# Altium schematic sheet Sheet2.SchDoc
size A4; SheetNumber: 2; SheetTotal: 3
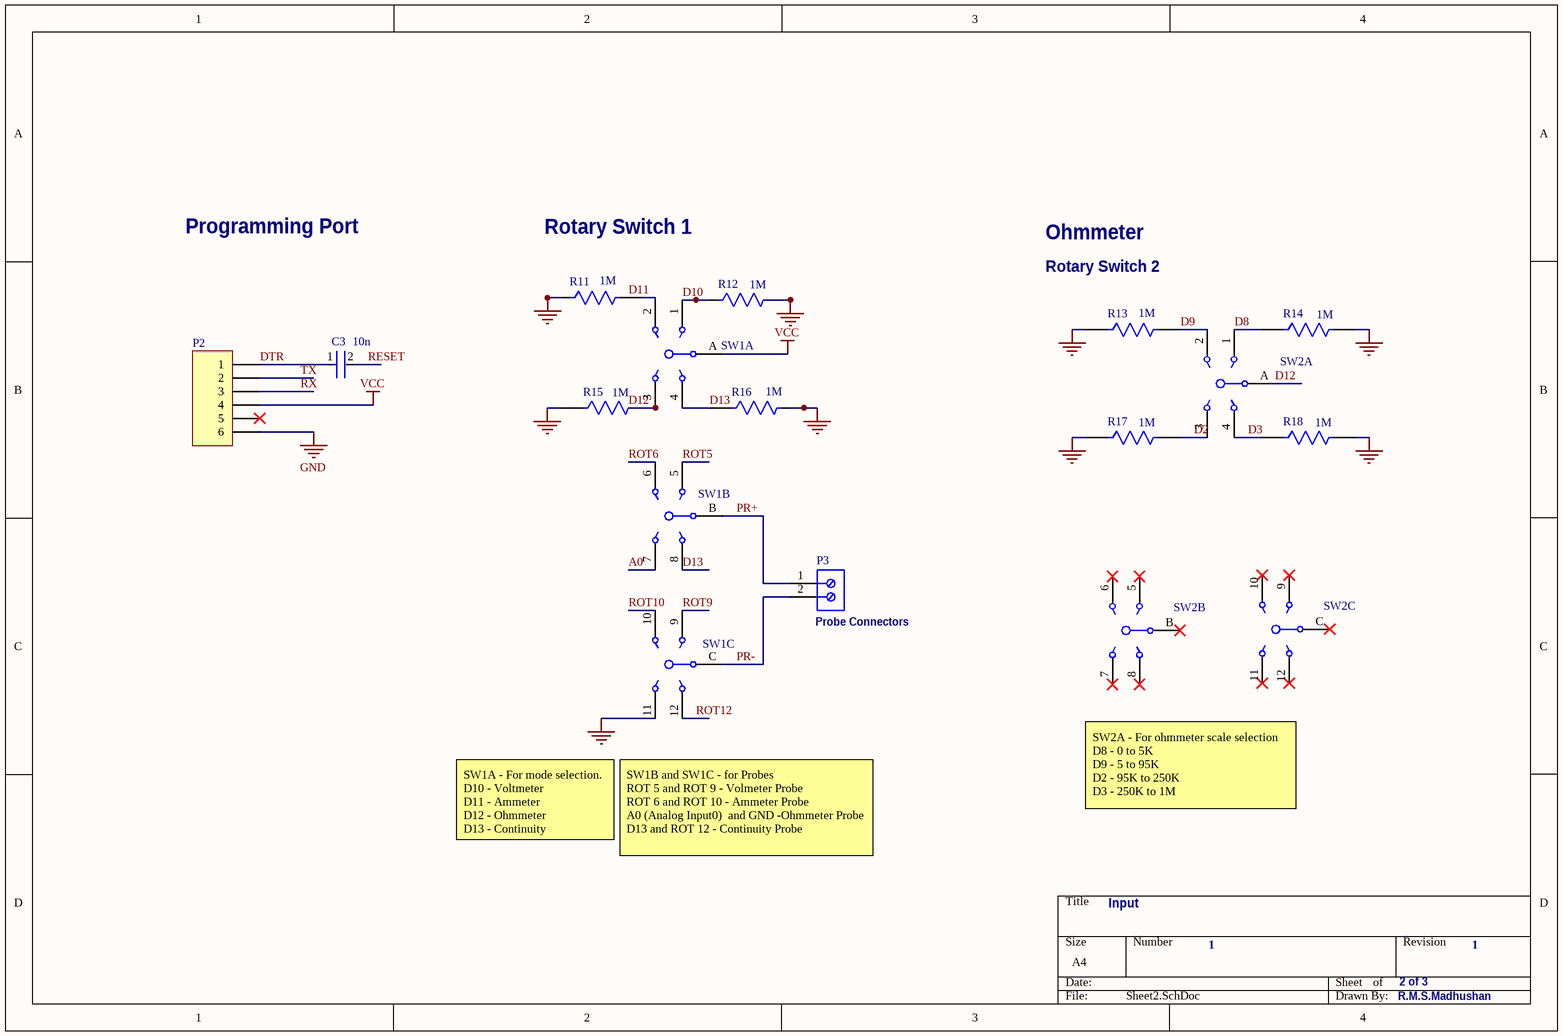
[diagram p0: Sheet2.SchDoc]

## Parts
C3  10n  [FP-RDE0M1-MFG]
P2  Header 6  [MY_FE06W]  (value not drawn)
P3  691214110002  [691214110002]  (value not drawn)
R11  1M  [FP-G001R1000FE1280-MFG]
R12  1M  [FP-G001R1000FE1280-MFG]
R13  1M  [FP-G001R1000FE1280-MFG]
R14  1M  [FP-G001R1000FE1280-MFG]
R15  1M  [FP-G001R1000FE1280-MFG]
R16  1M  [FP-G001R1000FE1280-MFG]
R17  1M  [FP-G001R1000FE1280-MFG]
R18  1M  [FP-G001R1000FE1280-MFG]
SW1  A30403RNZQ  [CKCP-A30403RNZQ-15_V]  (value not drawn)  (parts A,B,C of 3)
SW2  A30403RNZQ  [CKCP-A30403RNZQ-15_V]  (value not drawn)  (parts A,B,C of 3)

## Nets
GND: P2.6 R11.1 R12.2 R13.1 R14.2 R15.1 R16.2 R17.1 R18.2 SW1.11
VCC: P2.4 SW1.A
A0: SW1.7
D2: R17.2 SW2.3
D3: R18.1 SW2.4
D8: R14.1 SW2.1
D9: R13.2 SW2.2
D10: R12.1 SW1.1
D12: R15.2 SW1.3 SW2.A
D13: R16.1 SW1.4 SW1.8
DTR: C3.1 P2.1
PR+: P3.1 SW1.B
PR-: P3.2 SW1.C
RESET: C3.2
ROT5: SW1.5
ROT6: SW1.6
ROT9: SW1.9
ROT10: SW1.10
ROT12: SW1.12
RX: P2.3
TX: P2.2
NetR11_2: R11.2 SW1.2

Not connected (* = marked no-connect by the designer): P2 5*; SW2 5* 6* 7* 8* 9* 10* 11* 12* B* C*

## Notes on the sheet
- Programming Port
- Rotary Switch 1
- Ohmmeter
- (near R13) Rotary Switch 2
- (near P3) Probe Connectors
- SW1A - For mode selection.
  D10 - Voltmeter
  D11 - Ammeter
  D12 - Ohmmeter
  D13 - Continuity
- SW1B and SW1C - for Probes
  ROT 5 and ROT 9 - Volmeter Probe
  ROT 6 and ROT 10 - Ammeter Probe
  A0 (Analog Input0)  and GND -Ohmmeter Probe
  D13 and ROT 12 - Continuity Probe
- SW2A - For ohmmeter scale selection
  D8 - 0 to 5K
  D9 - 5 to 95K
  D2 - 95K to 250K
  D3 - 250K to 1M
- Input
- 1
- 2 of 3
- R.M.S.Madhushan
- Labels drawn without touching a wire or pin: D11

## Library data of the parts
C3 = CMP-06035-055552-1: Ceramic Capacitor 22pF ±5% 50V C0G Radial; Lead Diameter: 0.5mm; Capacitance: 22pF; Width: 0.098inch; Dielectric: C0G; Length: 0.157inch; Max Operating Temperature: 125°C; Case/Package: Radial; Voltage Rating (DC): 50V; Lead Free: Lead Free; Voltage Rating: 50V; Termination: Radial; Mount: Through Hole; Tolerance: 5%; Resistor Type: Ceramic; Packaging: Bulk; Package Quantity: 500; Lead Pitch: 0.197inch; Min Operating Temperature: -55°C; Height - Seated (Max): 0.236inch; Height: 3.5mm
P2 = Header 6: Header, 6-Pin; ASiD Part Number: Header 6-AS
P3 = CMP-1502-02464-1: Serie 2141 - 3.50 mm Horizontal Entry Modular with Rising Cage Clamp WR-TBL, 2 pin; Manufacturer: Wurth Elektronik; Pin Number: 2; Pitch: 3.50mm; Datasheet URL: http://katalog.we-online.de/em/datasheet/6912141100xx.pdf; Packaging: Box; Mounting Technology: THT; Package Reference: 691214110002; Manufacturer URL: http://www.we-online.de; Part Number: 691214110002; Publisher: WurthElektronik; Operating Temperature: -40to105degC
R11-R18 = CMP-02408-000025-1: Res Wirewound 0.1 Ohm 1% 1W ±90ppm/°C Ceramic Hi Temp Sil AXL Thru-Hole Bulk; Resistance: 100mR; Case/Package: Ceramic; Construction: Cylindrical; Diameter: 2.16mm; Series: G; Tolerance: 1%; Max Operating Temperature: 250°C; Lead Free: Lead Free; Resistor Type: Wirewound; Contact Plating: Tin; Mount: Through Hole; Radiation Hardening: No; RoHS Compliant: Yes; Termination: Axial; Temperature Coefficient: 90ppm/°C; Min Operating Temperature: -65°C; Length: 7.14mm; Military Standard: Not; Packaging: Tape and Reel; Power Rating: 1W
SW1 SW2 = CMP-1076-00008-1: A Series Rotary Switch, 3 Poles, 4 Positions, 30 deg Angle of Throw, -30 to 85 degC, RoHS; Manufacturer: C&K Components; Angle of Throw: 30 deg; Position: 4; Pole: 3; Series: A; Temperature Range: -30 to 85 degC; PackageDescription: 15-Pin Through Hole Device, Dia 26.19 mm, Height 32.02 mm; RoHS: TRUE; ComponentLink1URL: http://www.ck-components.com/; ComponentLink3Description: Package Specification; ComponentLink2Description: Datasheet; PartNumber: A30403RNZQ; DatasheetVersion: 41821; ComponentLink1Description: Manufacturer URL; Mounting Technology: Through Hole; PackageReference: A30403RNZQ-15; ComponentLink2URL: http://www.ck-components.com/13397/arotary_9apr14.pdf/; ComponentLink3URL: http://www.ck-components.com/13397/arotary_9apr14.pdf/